# Altium schematic sheet Pressure Sensor.SchDoc
size A
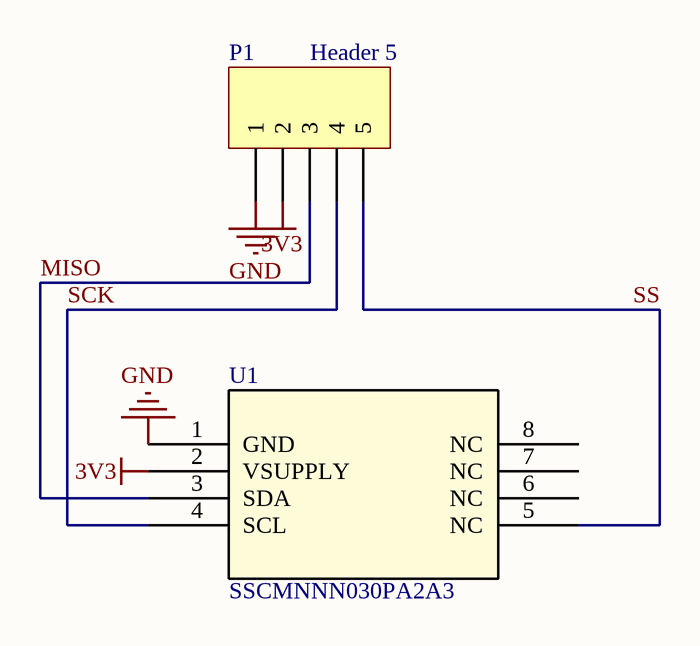
[diagram p0: Pressure Sensor.SchDoc]

## Parts
P1  Header 5  [CONN_B5B-XH-A (LF)(SN)_JST]
U1  SSCMNNN030PA2A3  [SSCMNN_HNW-L]

## Nets
3V3: P1.2 U1.2(VSUPPLY)
GND: P1.1 U1.1(GND)
MISO: P1.3 U1.3(SDA)
SCK: P1.4 U1.4(SCL)
SS: P1.5 U1.5(NC)

Not connected (* = marked no-connect by the designer): U1 6(NC) 7(NC) 8(NC)

## Library data of the parts
P1 = Header 5: Header, 5-Pin; LatestRevisionDate: 17-Jul-2002; LatestRevisionNote: Re-released for DXP Platform.; Publisher: Altium Limited
U1 = SSCMNNN030PA2A3: No Description Available; Vendor: Honeywell; Built_By: EMA_Cory; SourceLibrary: Honeywell_2020-09-30; Datasheet: https://sensing.honeywell.com/honeywell-sensing-trustability-ssc-series-standard-accuracy-board-mount-pressure-sensors-50099533-a-en.pdf; Manufacturer_Part_Number: SSCMNNN030PA2A3; Copyright: Copyright (C) 2018 Accelerated Designs. All rights reserved; RefDes: RefDes; Type: DEV